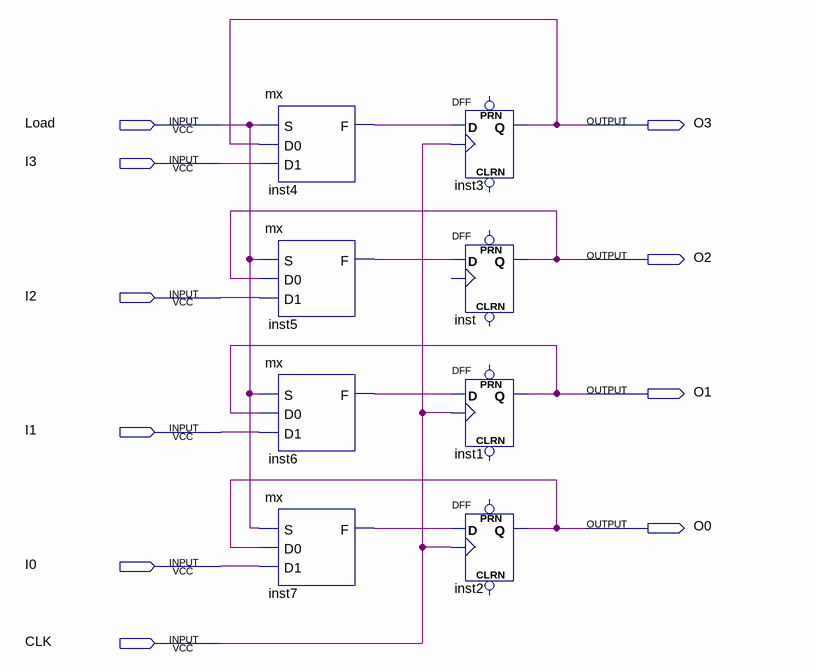
[diagram p0: schematic sheet]
// Quartus schematic 4bit.bdf as structural Verilog: 8 symbols, 10 pins
module \4bit  (
  input  Load,
  input  I3,
  input  I2,
  input  I1,
  input  I0,
  input  CLK,
  output O3,
  output O2,
  output O1,
  output O0
);

  wire inst4_f, inst5_f, inst6_f, inst7_f;

  mx inst4 (.S(Load), .D0(O3), .D1(I3), .F(inst4_f));
  mx inst5 (.S(Load), .D0(O2), .D1(I2), .F(inst5_f));
  mx inst6 (.S(Load), .D0(O1), .D1(I1), .F(inst6_f));
  mx inst7 (.S(Load), .D0(O0), .D1(I0), .F(inst7_f));
  DFF inst3 (.CLK(CLK), .D(inst4_f), .Q(O3));  // open: CLRN, PRN
  DFF inst (.D(inst5_f), .Q(O2));  // open: CLRN, CLK, PRN
  DFF inst1 (.CLK(CLK), .D(inst6_f), .Q(O1));  // open: CLRN, PRN
  DFF inst2 (.CLK(CLK), .D(inst7_f), .Q(O0));  // open: CLRN, PRN
endmodule
